# Altium schematic sheet educationalBoard.SchDoc
size A3; Organization: Altium Limited; Address1: L3, 12a Rodborough Rd; Address2: Frenchs Forest; Address3: NSW; Address4: Australia 2086
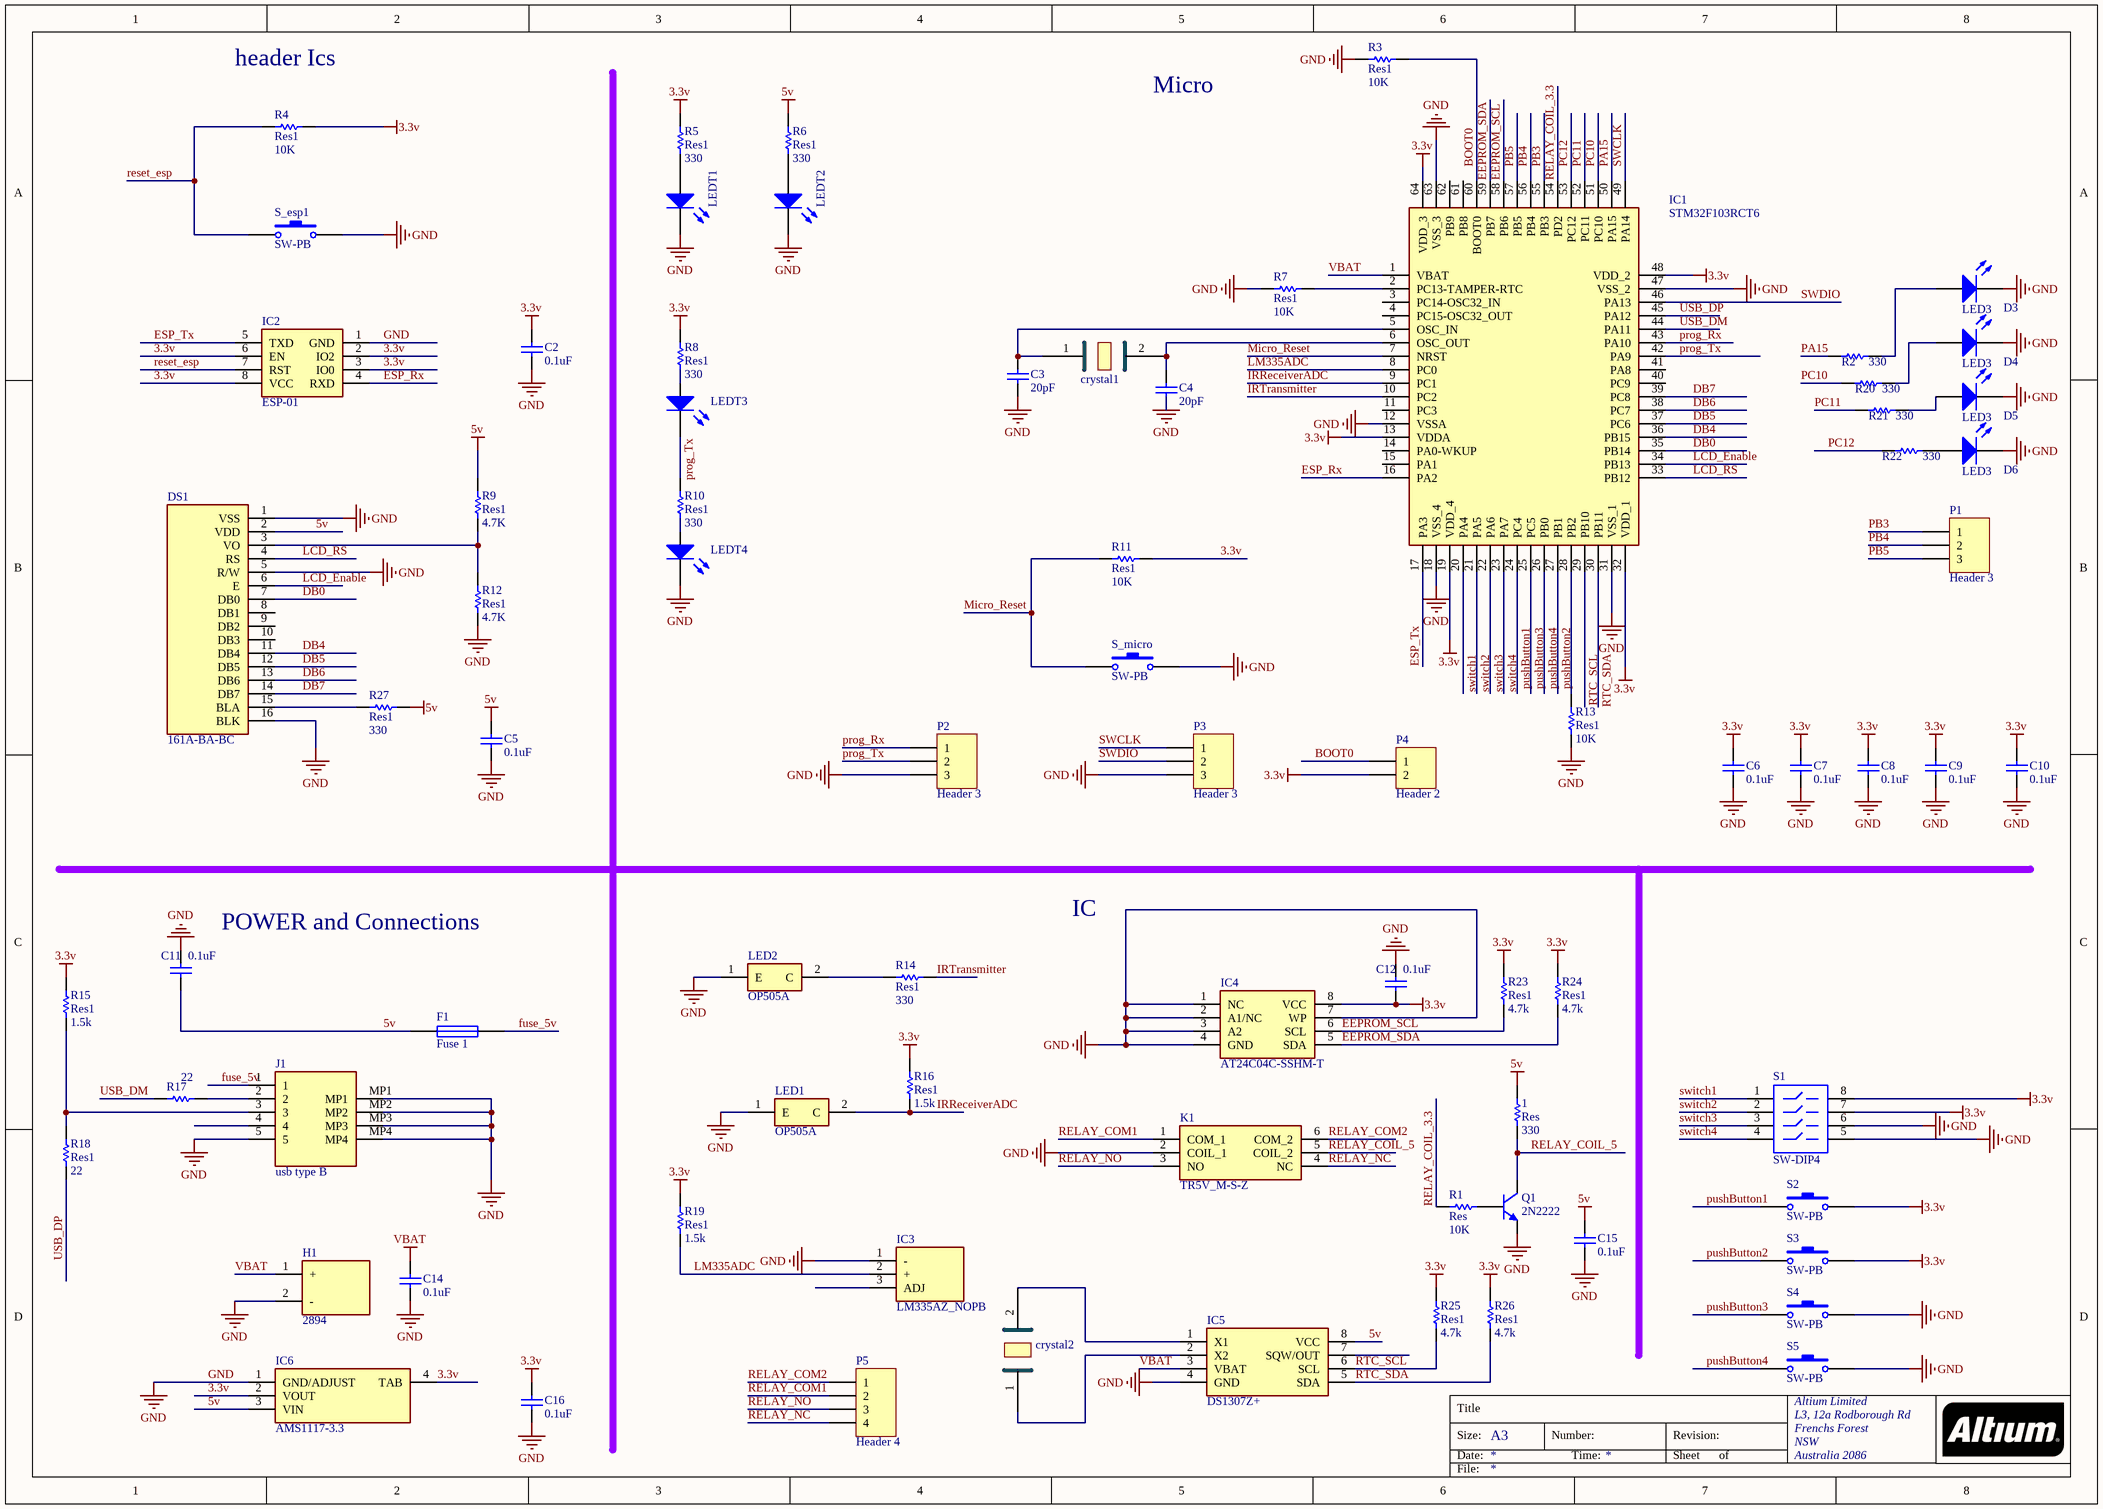
[diagram p0: educationalBoard.SchDoc]

## Parts
1  Res  value 330  [J1-0603]
C2  value 0.1uF  [J1-0603]  (hidden comment: C0603)
C3  value 20pF  [J1-0603]  (hidden comment: C0603)
C4  value 20pF  [J1-0603]  (hidden comment: C0603)
C5  value 0.1uF  [J1-0603]  (hidden comment: C0603)
C6  value 0.1uF  [J1-0603]  (hidden comment: C0603)
C7  value 0.1uF  [J1-0603]  (hidden comment: C0603)
C8  value 0.1uF  [J1-0603]  (hidden comment: C0603)
C9  value 0.1uF  [J1-0603]  (hidden comment: C0603)
C10  value 0.1uF  [J1-0603]  (hidden comment: C0603)
C11  value 0.1uF  [J1-0603]  (hidden comment: C0603)
C12  value 0.1uF  [J1-0603]  (hidden comment: C0603)
C14  value 0.1uF  [J1-0603]  (hidden comment: C0603)
C15  value 0.1uF  [J1-0603]  (hidden comment: C0603)
C16  value 0.1uF  [J1-0603]  (hidden comment: C0603)
crystal1  clockProducerDeep  [deep crystal]  (value not drawn)
crystal2  clockProducerDeep  [Deep Crystal small]  (value not drawn)
D3  LED3  [3518]
D4  LED3  [3518]
D5  LED3  [3518]
D6  LED3  [3518]
DS1  161A-BA-BC  [HDR1X16]
F1  Fuse 1  [0805]
H1  2894  [2894]
IC1  STM32F103RCT6  [QFP50P1200X1200X160-64N]
IC2  ESP-01  [HDR2X4]
IC3  LM335AZ_NOPB  [HDR1X3]
IC4  AT24C04C-SSHM-T  [SOIC127P600X175-8N]
IC5  DS1307Z+  [SOIC127P600X175-8N]
IC6  AMS1117-3.3  [SOT229P700X180-4N]
J1  usb type B  [0474910001]
K1  TR5V_M-S-Z  [TR5VMSZ]
LED1  OP505A  [OP505A]
LED2  OP505A  [OP505A]
LEDT1  (no value)  [3518]
LEDT2  (no value)  [3518]
LEDT3  (no value)  [3518]
LEDT4  (no value)  [3518]
P1  Header 3  [HDR1X3]
P2  Header 3  [HDR1X3]
P3  Header 3  [HDR1X3]
P4  Header 2  [HDR1X2]
P5  Header 4  [HDR1X4]
Q1  2N2222  [SOT-23]
R1  Res  value 10K  [J1-0603]
R2  value 330  [j1-0603]  (hidden comment: Res1)
R3  Res1  value 10K  [J1-0603]
R4  Res1  value 10K  [J1-0603]
R5  Res1  value 330  [j1-0603]
R6  Res1  value 330  [j1-0603]
R7  Res1  value 10K  [J1-0603]
R8  Res1  value 330  [j1-0603]
R9  Res1  value 4.7K  [J1-0603]
R10  Res1  value 330  [j1-0603]
R11  Res1  value 10K  [J1-0603]
R12  Res1  value 4.7K  [J1-0603]
R13  Res1  value 10K  [J1-0603]
R14  Res1  value 330  [J1-0603]
R15  Res1  value 1.5k  [J1-0603]
R16  Res1  value 1.5k  [J1-0603]
R17  value 22  [J1-0603]  (hidden comment: Res1)
R18  Res1  value 22  [J1-0603]
R19  Res1  value 1.5k  [J1-0603]
R20  value 330  [j1-0603]  (hidden comment: Res1)
R21  value 330  [j1-0603]  (hidden comment: Res1)
R22  value 330  [j1-0603]  (hidden comment: Res1)
R23  Res1  value 4.7k  [J1-0603]
R24  Res1  value 4.7k  [J1-0603]
R25  Res1  value 4.7k  [J1-0603]
R26  Res1  value 4.7k  [J1-0603]
R27  Res1  value 330  [J1-0603]
S1  SW-DIP4  [DIP-8]
S2  SW-PB  [button]
S3  SW-PB  [button]
S4  SW-PB  [button]
S5  SW-PB  [button]
S_esp1  SW-PB  [button]
S_micro  SW-PB  [button]

## Nets
3.3v: C2.1 C6.1 C7.1 C8.1 C9.1 C10.1 C12.1 C16.1 IC1.13(VDDA) IC1.19(VDD_4) IC1.32(VDD_1) IC1.48(VDD_2) IC1.64(VDD_3) IC2.2(IO2) IC2.3(IO0) IC2.6(EN) IC2.8(VCC) IC4.8(VCC) IC6.2(VOUT) IC6.4(TAB) P4.2 R4.2 R5.1 R8.1 R11.2 R15.2 R16.1 R19.2 R23.1 R24.1 R25.1 R26.1 S1.7 S1.8 S2.2 S3.2
5v: 1.2 C5.1 C11.1 C15.1 DS1.2(VDD) F1.1 IC5.8(VCC) IC6.3(VIN) R6.1 R9.2 R27.1
GND: C2.2 C3.1 C4.1 C5.2 C6.2 C7.2 C8.2 C9.2 C10.2 C11.2 C12.2 C14.2 C15.2 C16.2 D3.2(K) D4.2(K) D5.2(K) D6.2(K) DS1.1(VSS) DS1.5(R/W) DS1.16(BLK) H1.2(-) IC1.12(VSSA) IC1.18(VSS_4) IC1.31(VSS_1) IC1.47(VSS_2) IC1.63(VSS_3) IC2.1(GND) IC3.1(-) IC4.1(NC) IC4.2(A1/NC) IC4.3(A2) IC4.4(GND) IC4.7(WP) IC5.4(GND) IC6.1(GND/ADJUST) J1.5 J1.MP1 J1.MP2 J1.MP3 J1.MP4 K1.2(COIL_1) LED1.1(E) LED2.1(E) LEDT1.2(K) LEDT2.2(K) LEDT4.2(K) P2.3 P3.3 Q1.3(E) R3.2 R7.1 R12.1 R13.2 S1.5 S1.6 S4.2 S5.2 S_esp1.2 S_micro.2
VBAT: C14.1 H1.1(+) IC1.1(VBAT) IC5.3(VBAT)
BOOT0: IC1.60(BOOT0) P4.1 R3.1
DB0: DS1.7(DB0) IC1.35(PB14)
DB4: DS1.11(DB4) IC1.36(PB15)
DB5: DS1.12(DB5) IC1.37(PC6)
DB6: DS1.13(DB6) IC1.38(PC7)
DB7: DS1.14(DB7) IC1.39(PC8)
EEPROM_SCL: IC1.58(PB6) IC4.6(SCL) R23.2
EEPROM_SDA: IC1.59(PB7) IC4.5(SDA) R24.2
ESP_Rx: IC1.16(PA2) IC2.4(RXD)
ESP_Tx: IC1.17(PA3) IC2.5(TXD)
fuse_5v: F1.2 J1.1
IRReceiverADC: IC1.9(PC1) LED1.2(C) R16.2
IRTransmitter: IC1.10(PC2) R14.1
LCD_Enable: DS1.6(E) IC1.34(PB13)
LCD_RS: DS1.4(RS) IC1.33(PB12)
LM335ADC: IC1.8(PC0) IC3.2(+) R19.1
Micro_Reset: IC1.7(NRST) R11.1 S_micro.1
PA15: IC1.50(PA15) R2.2
PB3: IC1.55(PB3) P1.1
PB4: IC1.56(PB4) P1.2
PB5: IC1.57(PB5) P1.3
PC10: IC1.51(PC10) R20.1
PC11: IC1.52(PC11) R21.1
PC12: IC1.53(PC12) R22.1
prog_Rx: IC1.43(PA10) P2.1
prog_Tx: IC1.42(PA9) LEDT3.2(K) P2.2 R10.1
pushButton1: IC1.24(PC4) S2.1
pushButton2: IC1.27(PB1) S3.1
pushButton3: IC1.25(PC5) S4.1
pushButton4: IC1.26(PB0) S5.1
RELAY_COIL_3.3: IC1.54(PD2) R1.1
RELAY_COIL_5: 1.1 K1.5(COIL_2) Q1.1(C)
RELAY_COM1: K1.1(COM_1) P5.2
RELAY_COM2: K1.6(COM_2) P5.1
RELAY_NC: K1.4(NC) P5.4
RELAY_NO: K1.3(NO) P5.3
reset_esp: IC2.7(RST) R4.1 S_esp1.1
RTC_SCL: IC1.29(PB10) IC5.6(SCL) R25.2
RTC_SDA: IC1.30(PB11) IC5.5(SDA) R26.2
SWCLK: IC1.49(PA14) P3.1
SWDIO: IC1.46(PA13) P3.2
switch1: IC1.20(PA4) S1.1
switch2: IC1.21(PA5) S1.2
switch3: IC1.22(PA6) S1.3
switch4: IC1.23(PA7) S1.4
USB_DM: IC1.44(PA11) R17.2
USB_DP: IC1.45(PA12) R18.2
NetC3_2: C3.2 crystal1.1 IC1.5(OSC_IN)
NetC4_2: C4.2 crystal1.2 IC1.6(OSC_OUT)
Netcrystal2_1: crystal2.1 IC5.2(X2)
Netcrystal2_2: crystal2.2 IC5.1(X1)
NetD3_1: D3.1(A) R2.1
NetD4_1: D4.1(A) R20.2
NetD5_1: D5.1(A) R21.2
NetD6_1: D6.1(A) R22.2
NetDS1_3: DS1.3(VO) R9.1 R12.2
NetDS1_15: DS1.15(BLA) R27.2
NetIC1_2: IC1.2(PC13-TAMPER-RTC) R7.2
NetIC1_28: IC1.28(PB2) R13.1
NetJ1_2: J1.2 R17.1
NetJ1_3: J1.3 R15.1 R18.1
NetLED2_2: LED2.2(C) R14.2
NetLEDT1_1: LEDT1.1(A) R5.2
NetLEDT2_1: LEDT2.1(A) R6.2
NetLEDT3_1: LEDT3.1(A) R8.2
NetLEDT4_1: LEDT4.1(A) R10.2
NetQ1_2: Q1.2(B) R1.2

Not connected (* = marked no-connect by the designer): DS1 8(DB1) 9(DB2) 10(DB3); IC1 3(PC14-OSC32_IN) 4(PC15-OSC32_OUT) 11(PC3) 14(PA0-WKUP) 15(PA1) 40(PC9) 41(PA8) 61(PB8) 62(PB9); IC3 3(ADJ); IC5 7(SQW/OUT); J1 4

## Notes on the sheet
- header Ics
- Micro
- IC
- (near C11) POWER and Connections
- Title
- Size:
- Date:
- A3
- Number:
- Time:
- Revision:
- Sheet
- of
- File:

## Library data of the parts
1 R1 = Res: Semiconductor Resistor; Published: 8-Jun-2000; LatestRevisionDate: 17-Jul-2002; LatestRevisionNote: Re-released for DXP Platform.; PackageReference: AXIAL-0.5; Publisher: Altium Limited
C2-C12 C14-C16 = C0603: Ceramic Chip Capacitor - Standard; Note: Footprint corresponds to dimensions for bulk cassette packaging. This case size has tightened tolerances.; Published: 17-Jul-2002; LatestRevisionDate: 19-Mar-2004; LatestRevisionNote: Silkscreen size reduced.; DatasheetDocument: Mar-2001; PackageDocument: Mar-2001; PackageReference: 0603; Publisher: Altium Limited; Code_JEITA: 0603; Code_IPC: 1608 [0603]; ComponentLink1Description: Manufacturer Link; ComponentLink1URL: http://www.kemet.com/; ComponentLink2Description: Datasheet; ComponentLink2URL: http://www.kemet.com/kemet/web/homepage/kechome.nsf/vapubfilesname/F3102TA.pdf/$file/F3102TA.pdf
crystal1 crystal2 = deep crystal
D3-D6 = LED3: Typical BLUE SiC LED; Published: 8-Jun-2000; LatestRevisionDate: 17-Dec-2003; LatestRevisionNote: PCB Footprint replaced.; DatasheetVersion: 16-Apr-2002; PackageVersion: 16-Apr-2002; PackageReference: 3.5X2.8X1.9; Publisher: Altium Limited; PackageDescription: SM LED; 2 C-Bend Leads; Body 3.5 x 2.8 x 1.9 mm, inc leads (LxWxH typ)
DS1 = 161A-BA-BC: Display; Manufacturer_Name: Displaytech; Datasheet Link: https://docs-emea.rs-online.com/webdocs/06dd/0900766b806dda14.pdf; Height: 11mm; Manufacturer_Part_Number: 161A-BA-BC
F1 = Fuse 1: Fuse; Published: 8-Jun-2000; LatestRevisionDate: 17-Jul-2002; LatestRevisionNote: Re-released for DXP Platform.; PackageReference: PIN-W2/E2.8; Publisher: Altium Limited; PackageDescription: Thru-Hole; 2 Leads
H1 = 2894: Hardware; Manufacturer_Name: Keystone Electronics; Datasheet Link: https://www.keyelco.com/product-pdf.cfm?p=14467; Height: 2.42mm; Manufacturer_Part_Number: 2894; Mouser Part Number: 534-2894; Mouser Price/Stock: https://www.mouser.co.uk/ProductDetail/Keystone-Electronics/2894?qs=u16ybLDytRb94n%2F3dXyVLQ%3D%3D
IC1 = STM32F103RCT6: Integrated Circuit; Manufacturer_Name: STMicroelectronics; Datasheet Link: http://www.st.com/st-web-ui/static/active/en/resource/technical/document/datasheet/CD00191185.pdf; Height: 1.6mm; Manufacturer_Part_Number: STM32F103RCT6; Mouser Part Number: 511-STM32F103RCT6; Mouser Price/Stock: https://www.mouser.co.uk/ProductDetail/STMicroelectronics/STM32F103RCT6?qs=%252BB84zevwoRA6TYzZIgOIoA%3D%3D; Arrow Part Number: STM32F103RCT6; Arrow Price/Stock: https://www.arrow.com/en/products/stm32f103rct6/stmicroelectronics
IC2 = ESP-01: Integrated Circuit; pin to pad: 1>2 2>4 3>6 4>8 5>1 6>3 7>5 8>7; Manufacturer_Name: Ai-Thinker; Datasheet Link: http://wiki.ai-thinker.com/_media/esp8266/esp8266_series_modules_user_manual_v1.1.pdf; Height: 2mm; Manufacturer_Part_Number: ESP-01
IC3 = LM335AZ_NOPB: Integrated Circuit; Manufacturer_Name: Texas Instruments; Manufacturer_Part_Number: LM335AZ/NOPB; Datasheet Link: http://www.ti.com/general/docs/suppproductinfo.tsp?distId=10&gotoUrl=http%3A%2F%2Fwww.ti.com%2Flit%2Fgpn%2Flm135; Height: 3.25mm; Mouser Part Number: 926-LM335AZ/NOPB; Mouser Price/Stock: https://www.mouser.co.uk/ProductDetail/Texas-Instruments/LM335AZ-NOPB?qs=X1J7HmVL2ZHLFIuAm4Dkiw%3D%3D; Arrow Part Number: LM335AZ/NOPB; Arrow Price/Stock: https://www.arrow.com/en/products/lm335aznopb/texas-instruments
IC4 = AT24C04C-SSHM-T: Integrated Circuit; Manufacturer_Name: Microchip; Datasheet Link: https://datasheet.lcsc.com/szlcsc/Microchip-Tech-AT24C04C-SSHM-T_C6205.pdf; Height: 1.75mm; Manufacturer_Part_Number: AT24C04C-SSHM-T; Mouser Part Number: 556-AT24C04C-SSHM-T; Mouser Price/Stock: https://www.mouser.co.uk/ProductDetail/Microchip-Technology-Atmel/AT24C04C-SSHM-T?qs=rNaVQffb%252BtcPg4SMgvVriA%3D%3D; Arrow Part Number: AT24C04C-SSHM-T; Arrow Price/Stock: https://www.arrow.com/en/products/at24c04c-sshm-t/microchip-technology
IC5 = DS1307Z+: Integrated Circuit; Manufacturer_Name: Maxim Integrated; Datasheet Link: http://datasheets.maximintegrated.com/en/ds/DS1307.pdf; Height: 1.75mm; Manufacturer_Part_Number: DS1307Z+; Mouser Part Number: 700-DS1307Z; Mouser Price/Stock: https://www.mouser.co.uk/ProductDetail/Maxim-Integrated/DS1307Z%2b?qs=0Y9aZN%252BMVCUvNDMAh9aCtw%3D%3D
IC6 = AMS1117-1.5: Integrated Circuit; Manufacturer_Name: ams; Datasheet Link: http://www.advanced-monolithic.com/pdf/ds1117.pdf; Height: 1.8mm; Manufacturer_Part_Number: AMS1117-1.5
J1 = 0474910001: Connector; Manufacturer_Name: Molex; Datasheet Link: https://www.molex.com/pdm_docs/sd/474910001_sd.pdf; Height: 2.94mm; Manufacturer_Part_Number: 0474910001; Arrow Part Number: 0474910001; Arrow Price/Stock: https://www.arrow.com/en/products/0474910001/molex
K1 = TR5V_M-S-Z: Relay or Contactor; Manufacturer_Name: TIANBO Electronics; Manufacturer_Part_Number: TR5V M-S-Z; Datasheet Link: http://www.datasheetspdf.com/pdf/702912/TIANBOGANGLIANELECTRONICS/TR5V/1; Height: 9mm
LED1 LED2 = OP505A: LED (Multiple); Manufacturer_Name: OPTEK TECHNOLOGY; Datasheet Link: http://docs-emea.rs-online.com/webdocs/13ff/0900766b813ff04e.pdf; Height: 5.84mm; Manufacturer_Part_Number: OP505A; Mouser Part Number: 828-OP505A; Mouser Price/Stock: https://www.mouser.co.uk/ProductDetail/Optek-TT-Electronics/OP505A?qs=MYMjFsmMg9aCx6EE%252BoFElA%3D%3D; Arrow Part Number: OP505A; Arrow Price/Stock: https://www.arrow.com/en/products/op505a/optek-technology
LEDT1-LEDT4 = LED3: Typical BLUE SiC LED; pin to pad: 1>2 2>1; Published: 8-Jun-2000; LatestRevisionDate: 17-Dec-2003; LatestRevisionNote: PCB Footprint replaced.; DatasheetDocument: 16-Apr-2002; PackageDocument: 16-Apr-2002; PackageReference: 3.5X2.8X1.9; Publisher: Altium Limited
P1-P3 = Header 3: Header, 3-Pin; LatestRevisionDate: 17-Jul-2002; LatestRevisionNote: Re-released for DXP Platform.; Publisher: Altium Limited
P4 = Header 2: Header, 2-Pin; LatestRevisionDate: 17-Jul-2002; LatestRevisionNote: Re-released for DXP Platform.; Publisher: Altium Limited
P5 = Header 4: Header, 4-Pin; LatestRevisionDate: 17-Jul-2002; LatestRevisionNote: Re-released for DXP Platform.; Publisher: Altium Limited
Q1 = 2N2222: NPN Bipolar Transistor; Published: 8-Jun-2000; LatestRevisionDate: 17-Jul-2002; LatestRevisionNote: Re-released for DXP Platform.; PackageReference: TO-226; Publisher: Altium Limited; Code_JEDEC: TO-226-AA
R2-R27 = Res1: Resistor; Published: 8-Jun-2000; LatestRevisionDate: 17-Jul-2002; LatestRevisionNote: Re-released for DXP Platform.; PackageReference: AXIAL-0.3; Publisher: Altium Limited
  R3 R4 R7 R9 R11-R19 R23-R27: PackageDescription: Axial Device, Thru-Hole; 2 Leads; 0.3 in Pin Spacing
S1 = SW-DIP4: DIP Switch; Published: 24-Mar-1999; LatestRevisionDate: 17-Jul-2002; LatestRevisionNote: Re-released for DXP Platform.; PackageReference: DIP-8; Publisher: Altium Limited
S2-S5 S_esp1 S_micro = SW-PB: Switch; Published: 24-Mar-1999; LatestRevisionDate: 17-Jul-2002; LatestRevisionNote: Re-released for DXP Platform.; PackageReference: SPST-2; Publisher: Altium Limited
  S2-S5: PackageDescription: Switch; 2 Leads